# Altium schematic sheet SD Card.SchDoc
size A4
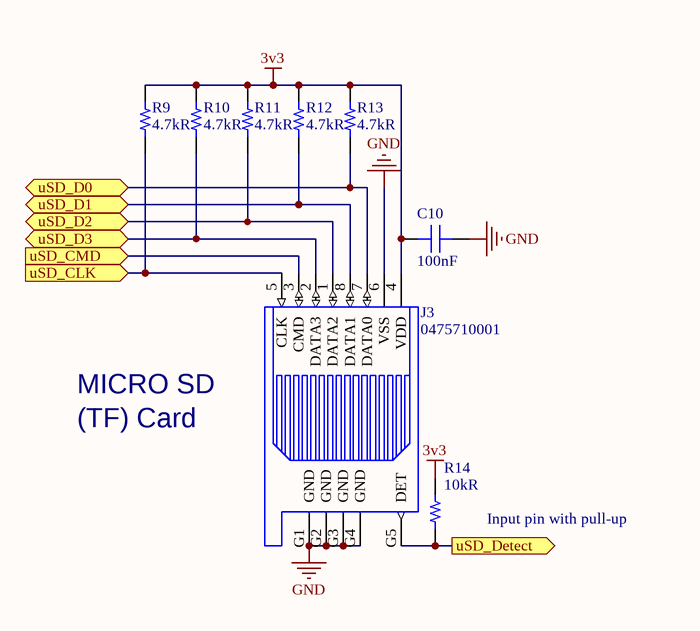
[diagram p0: SD Card.SchDoc]

## Parts
C10  100nF  [CAP 0603/1608]
J3  0475710001  [Molex - 0475710001]
R9  4.7kR  [RES 0603/1608]
R10  4.7kR  [RES 0603/1608]
R11  4.7kR  [RES 0603/1608]
R12  4.7kR  [RES 0603/1608]
R13  4.7kR  [RES 0603/1608]
R14  10kR  [RES 0603/1608]

## Ports
uSD_CLK (in), uSD_CMD (in), uSD_D0 (bidir), uSD_D1 (bidir), uSD_D2 (bidir), uSD_D3 (bidir), uSD_Detect (out)

## Nets
3v3: C10.2 J3.4(VDD) R9.2 R10.2 R11.2 R12.2 R13.2 R14.2
GND: C10.1 J3.6(VSS) J3.G1(GND) J3.G2(GND) J3.G3(GND) J3.G4(GND)
uSD_CLK: J3.5(CLK) R9.1 ; port uSD_CLK
uSD_CMD: J3.3(CMD) ; port uSD_CMD
uSD_D0: J3.7(DATA0) R13.1 ; port uSD_D0
uSD_D1: J3.8(DATA1) R12.1 ; port uSD_D1
uSD_D2: J3.1(DATA2) R11.1 ; port uSD_D2
uSD_D3: J3.2(DATA3) R10.1 ; port uSD_D3
uSD_Detect: J3.G5(DET) R14.1 ; port uSD_Detect

## Notes on the sheet
- MICRO SD
- (TF) Card
- (near R14) Input pin with pull-up

## Library data of the parts
C10 = Capacitor - Ceramic: Ceramic, SMT Capacitor; Manufacturer: Samsung; Manufacturer Part Number: CL10B104JB8NNNC; Tolerance: 5%; Voltage Rating: 50V; Dielectric: X7R; Supplier 1: Digi-Key; Supplier Part Number 1: 1276-1033-1-ND; Stock 1: 223594; Pricing 1: 1 = 0,10000, 10 = 0,05300, 100 = 0,02350, 500 = 0,01680, 1000 = 0,01320 (USD); RoHS: Yes; Mount: Surface Mount; Case/Package: 0603; Case Code (Metric): 1608; Case Code (Imperial): 0603; Material: Ceramic; Contact Plating: Tin; Min Operating Temperature: -55°C; Max Operating Temperature: 125°C; Packaging: Tape and Reel; Package Quantity: 1; Capacitance: 100nF; Voltage: 50V; Length: 1.6mm; Height: 0.8mm; Width: 0.031inch; Thickness: 0.035inch; Depth: 0.8mm; Radiation Hardening: No; ComponentLink1URL: https://media.digikey.com/pdf/Data%20Sheets/Samsung%20PDFs/CL_Series_MLCC_ds.pdf?src-supplier=Digi-Key; ComponentLink1Description: https://media.digikey.com/pdf/Data%20Sheets/Samsung%20PDFs/CL_Series_MLCC_ds.pdf?src-supplier=Digi-Key; ComponentLink2URL: https://www.verical.com/server-webapp/html/getDatasheet?partID=359321&src-supplier=Verical; ComponentLink2Description: https://www.verical.com/server-webapp/html/getDatasheet?partID=359321&src-supplier=Verical; ComponentLink3URL: http://www1.futureelectronics.com/doc/SAMSUNG/CL10B104JB8NNNC.pdf?src-supplier=Future+Electronics; ComponentLink3Description: http://www1.futureelectronics.com/doc/SAMSUNG/CL10B104JB8NNNC.pdf?src-supplier=Future+Electronics; ComponentLink4URL: https://produktinfo.conrad.com/datenblaetter/450000-474999/456613-da-01-en-VS_KONDENSATOR_0603.pdf?src-supplier=Conrad; ComponentLink4Description: https://produktinfo.conrad.com/datenblaetter/450000-474999/456613-da-01-en-VS_KONDENSATOR_0603.pdf?src-supplier=Conrad
J3 = uSD Card: Connector; Manufacturer: Molex; Number of Contacts: 8; Pitch: 1.1mm; Datasheet Link: https://www.molex.com/pdm_docs/sd/475710001_sd.pdf; Height: 2.3mm; Manufacturer Part Number: 0475710001; Supplier 1: Digi-Key; Supplier Part Number 1: WM9731CT-ND; Stock 1: 37136; Pricing 1: 1 = 1,030000, 10 = 0,906000, 25 = 0,852400, 50 = 0,817000, 100 = 0,781400, 250 = 0,710400, 500 = 0,639340 (USD); RoHS: Yes; Mount: Surface Mount; Contact Material: Bronze; Housing Material: Polymer; Contact Plating: Gold; Min Operating Temperature: -40°C; Max Operating Temperature: 85°C; Package Quantity: 1500; Packaging: Tape and Reel; Termination: Solder; Orientation: Right Angle; Number of Rows: 1; Connector Type: Connector; Length: 11.4mm; Depth: 5.45mm; ComponentLink1URL: https://datasheet.ciiva.com/15082/475710001-sd-15082838.pdf?src-supplier=Digi-Key; ComponentLink1Description: https://datasheet.ciiva.com/15082/475710001-sd-15082838.pdf?src-supplier=Digi-Key; ComponentLink2URL: https://datasheet.ciiva.com/3938/228290475710001-memory-card-socket-3938351.pdf?src-supplier=Arrow; ComponentLink2Description: https://datasheet.ciiva.com/3938/228290475710001-memory-card-socket-3938351.pdf?src-supplier=Arrow; ComponentLink3URL: https://datasheet.ciiva.com/2943/0475710001-memory-card-socket-2943559.pdf?src-supplier=Digi-Key; ComponentLink3Description: https://datasheet.ciiva.com/2943/0475710001-memory-card-socket-2943559.pdf?src-supplier=Digi-Key; ComponentLink4URL: https://datasheet.ciiva.com/15082/475710001-sd-15082839.pdf?src-supplier=Digi-Key; ComponentLink4Description: https://datasheet.ciiva.com/15082/475710001-sd-15082839.pdf?src-supplier=Digi-Key; ComponentLink5URL: https://datasheet.ciiva.com/15082/475710001-sd-15082840.pdf?src-supplier=Digi-Key; ComponentLink5Description: https://datasheet.ciiva.com/15082/475710001-sd-15082840.pdf?src-supplier=Digi-Key
R9-R13 = Resistor_Chip: Ceramic, SMT Capacitor; Manufacturer: Yageo; Manufacturer Part Number: RC0603JR-074K7L; Voltage Rating (DC): 50V; Tolerance: 5%; Power Rating: 100mW; Temperature Coefficient: 100ppm/°C; Supplier 1: Digi-Key; Supplier Part Number 1: 311-4.7KGRCT-ND; Stock 1: 18785107; Pricing 1: 1 = 0,10000, 10 = 0,02000, 100 = 0,00810, 1000 = 0,00362, 2500 = 0,00314 (USD); RoHS: Yes; Case/Package: 0603; Number of Pins: 2; Case Code (Imperial): 0603; Case Code (Metric): 1608; Min Operating Temperature: -55°C; Max Operating Temperature: 155°C; Resistance: 4.7kR; Packaging: Tape and Reel; Voltage Rating: 50V; Termination: SMD/SMT; Composition: Thick Film; Military Standard: Not; Length: 1.6mm; Width: 0.8mm; Depth: 0.8mm; REACH SVHC: No SVHC; Lead Free: Lead Free; ComponentLink1URL: https://datasheet.ciiva.com/46412/443971-46412858.pdf?src-supplier=Element14; ComponentLink1Description: https://datasheet.ciiva.com/46412/443971-46412858.pdf?src-supplier=Element14
R14 = Resistor_Chip: Ceramic, SMT Capacitor; Manufacturer: Stackpole Electronics; Manufacturer Part Number: RNCP0603FTD10K0; Tolerance: 1%; Max Power Dissipation: 125mW; Temperature Coefficient: 100ppm/°C; Supplier 1: Digi-Key; Supplier Part Number 1: RNCP0603FTD10K0CT-ND; Stock 1: 183083; Pricing 1: 1 = 0,10000, 10 = 0,06700, 100 = 0,02730, 1000 = 0,01224, 2500 = 0,01063 (USD); RoHS: Yes; Mount: Surface Mount; Case/Package: 0603; Case Code (Metric): 1608; Case Code (Imperial): 0603; Contact Plating: Matte,Tin; Min Operating Temperature: -55°C; Max Operating Temperature: 155°C; Packaging: Tape and Reel; Resistance: 10kR; Composition: Thin Film; Number of Terminations: 2; Features: Anti-Sulfur,Moisture Resistant; Length: 0.059inch; Height: 0.02inch; Width: 0.031inch; Radiation Hardening: No; Lead Free: Lead Free